# EAGLE design Power_Block (EAGLE 5.06)
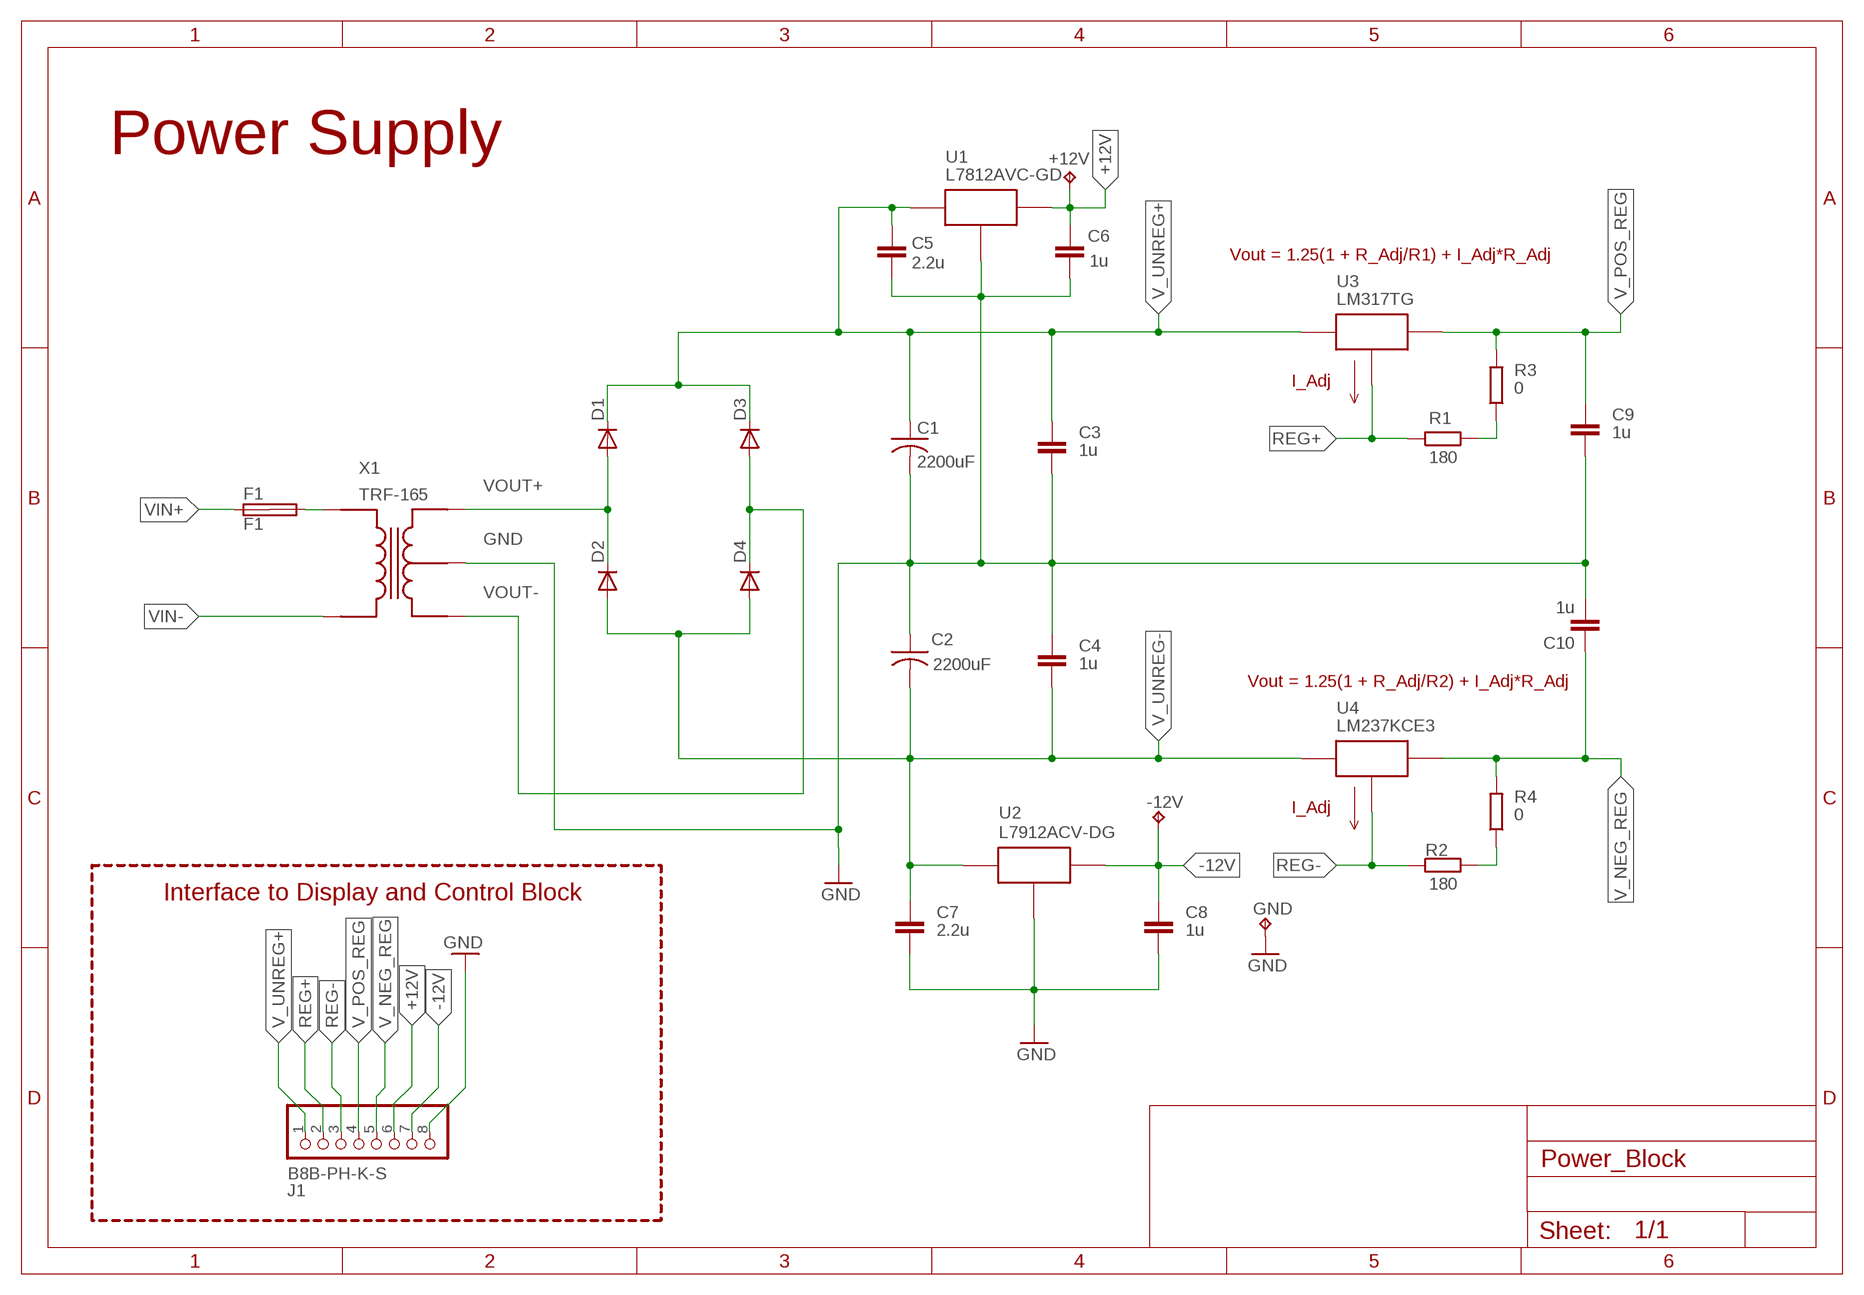
[diagram p0: schematic, sheet 1]

## Parts
+12V  TPTP20SQ  [TP20SQ]
-12V  TPTP20SQ  [TP20SQ]
C1  2200uF  ESK228M  [ESK228M]
C2  2200uF  ESK228M  [ESK228M]
C3  1u  C-EU025-024X044  [C025-024X044]
C4  1u  C-EU025-024X044  [C025-024X044]
C5  2.2u  C-EU025-024X044  [C025-024X044]
C6  1u  C-EU025-024X044  [C025-024X044]
C7  2.2u  C-EU025-024X044  [C025-024X044]
C8  1u  C-EU025-024X044  [C025-024X044]
C9  1u  C-EU025-024X044  [C025-024X044]
C10  1u  C-EU025-024X044  [C025-024X044]
D1  VS-2EFH02HM3/I  [DO-219AB]
D2  VS-2EFH02HM3/I  [DO-219AB]
D3  VS-2EFH02HM3/I  [DO-219AB]
D4  VS-2EFH02HM3/I  [DO-219AB]
F1  F1  SHK20L  [SHK20L]
GND  TPTP20SQ  [TP20SQ]
J1  B8B-PH-K-S  [B8B-PH-K-S]
R1  180  R-EU_R0603  [R0603]
R2  180  R-EU_R0603  [R0603]
R3  0  R-EU_R0603  [R0603]
R4  0  R-EU_R0603  [R0603]
U1  L7812AVC-GD  [T0-220]
U2  L7912ACV-DG  [T0-220]
U3  LM317TG  [T0-220]
U4  LM237KCE3  [T0-220]
X1  TRF-165  [TRF-165]

## Nets
+12V: +12V.TP C6.2 J1.6 U1.P3
-12V: -12V.TP C8.2 J1.7 U2.P3
GND: C1.LL- C2.LL+ C3.1 C4.2 C5.1 C6.1 C7.1 C8.1 C9.1 C10.2 GND.TP J1.8 U1.P2 U2.P1 X1.GND
N$15: R2.2 R4.1
N$17: R1.2 R3.1
N$20: F1.2A X1.VIN1
REG+: J1.2 R1.1 U3.P1
REG-: J1.3 R2.1 U4.P1
V_NEG_REG: C10.1 J1.5 R4.2 U4.P3
V_POS_REG: C9.2 J1.4 R3.2 U3.P2
V_UNREG+: C1.LL+ C3.2 C5.2 D1.C D3.C J1.1 U1.P1 U3.P3
V_UNREG-: C2.LL- C4.1 C7.2 D2.A D4.A U2.P2 U4.P2
VIN+: F1.1A
VIN-: X1.VIN2
VOUT+: D1.A D2.C X1.VOUT+
VOUT-: D3.A D4.C X1.VOUT-
Unconnected: F1.1B F1.2B

## Notes on the sheet
- Power Supply
- Vout = 1.25(1 + R_Adj/R1) + I_Adj*R_Adj
- I_Adj
- Vout = 1.25(1 + R_Adj/R2) + I_Adj*R_Adj
- I_Adj
- Interface to Display and Control Block

## Library data of the parts
+12V -12V GND = testpad:TP: Test pad
C1 C2 = VladimirG:ESK228M
C3-C10 = rcl:C-EU: CAPACITOR, European symbol
D1-D4 = VladimirG:VS-2EFH02HM3/I
F1 = fuse:SHK20L: FUSE HOLDER 5 x 20 mm, SH contact, SHH1 Schukat, E1073 Buerklin
J1 = VladimirG:B8B-PH-K-S: CONN HEADER VERT 8POS 2MM
R1-R4 = rcl:R-EU_: RESISTOR, European symbol
U1 = VladimirG:L7812AVC-GD: IC REG LINEAR 12V 1.5A TO220AB
U2 = VladimirG:L7912ACV-DG
U3 = VladimirG:LM317TG
U4 = VladimirG:LM237KCE3
X1 = VladimirG:TRF-165

## Board
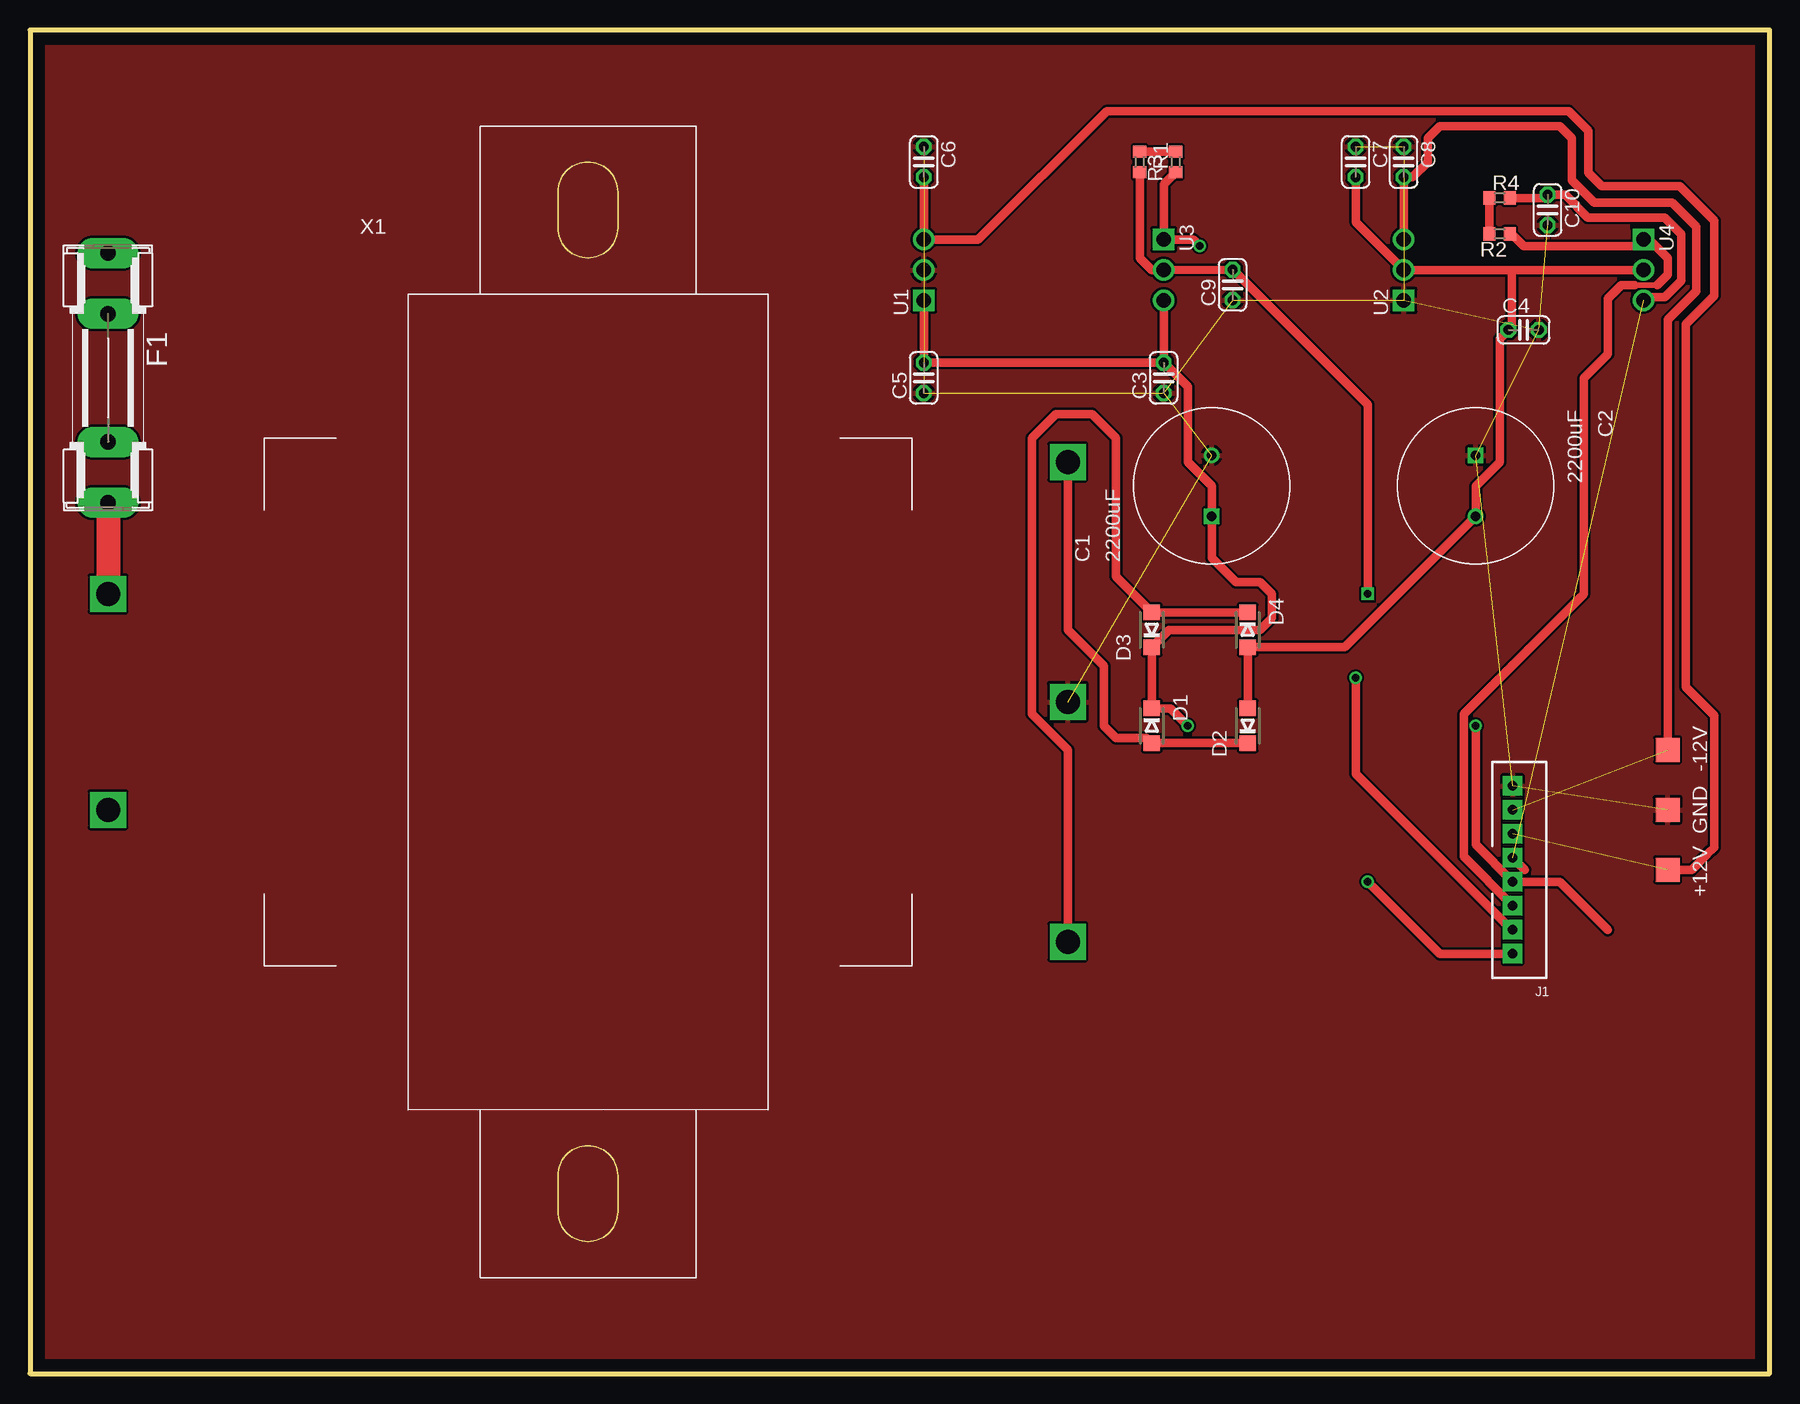
[diagram p1: board, top side]
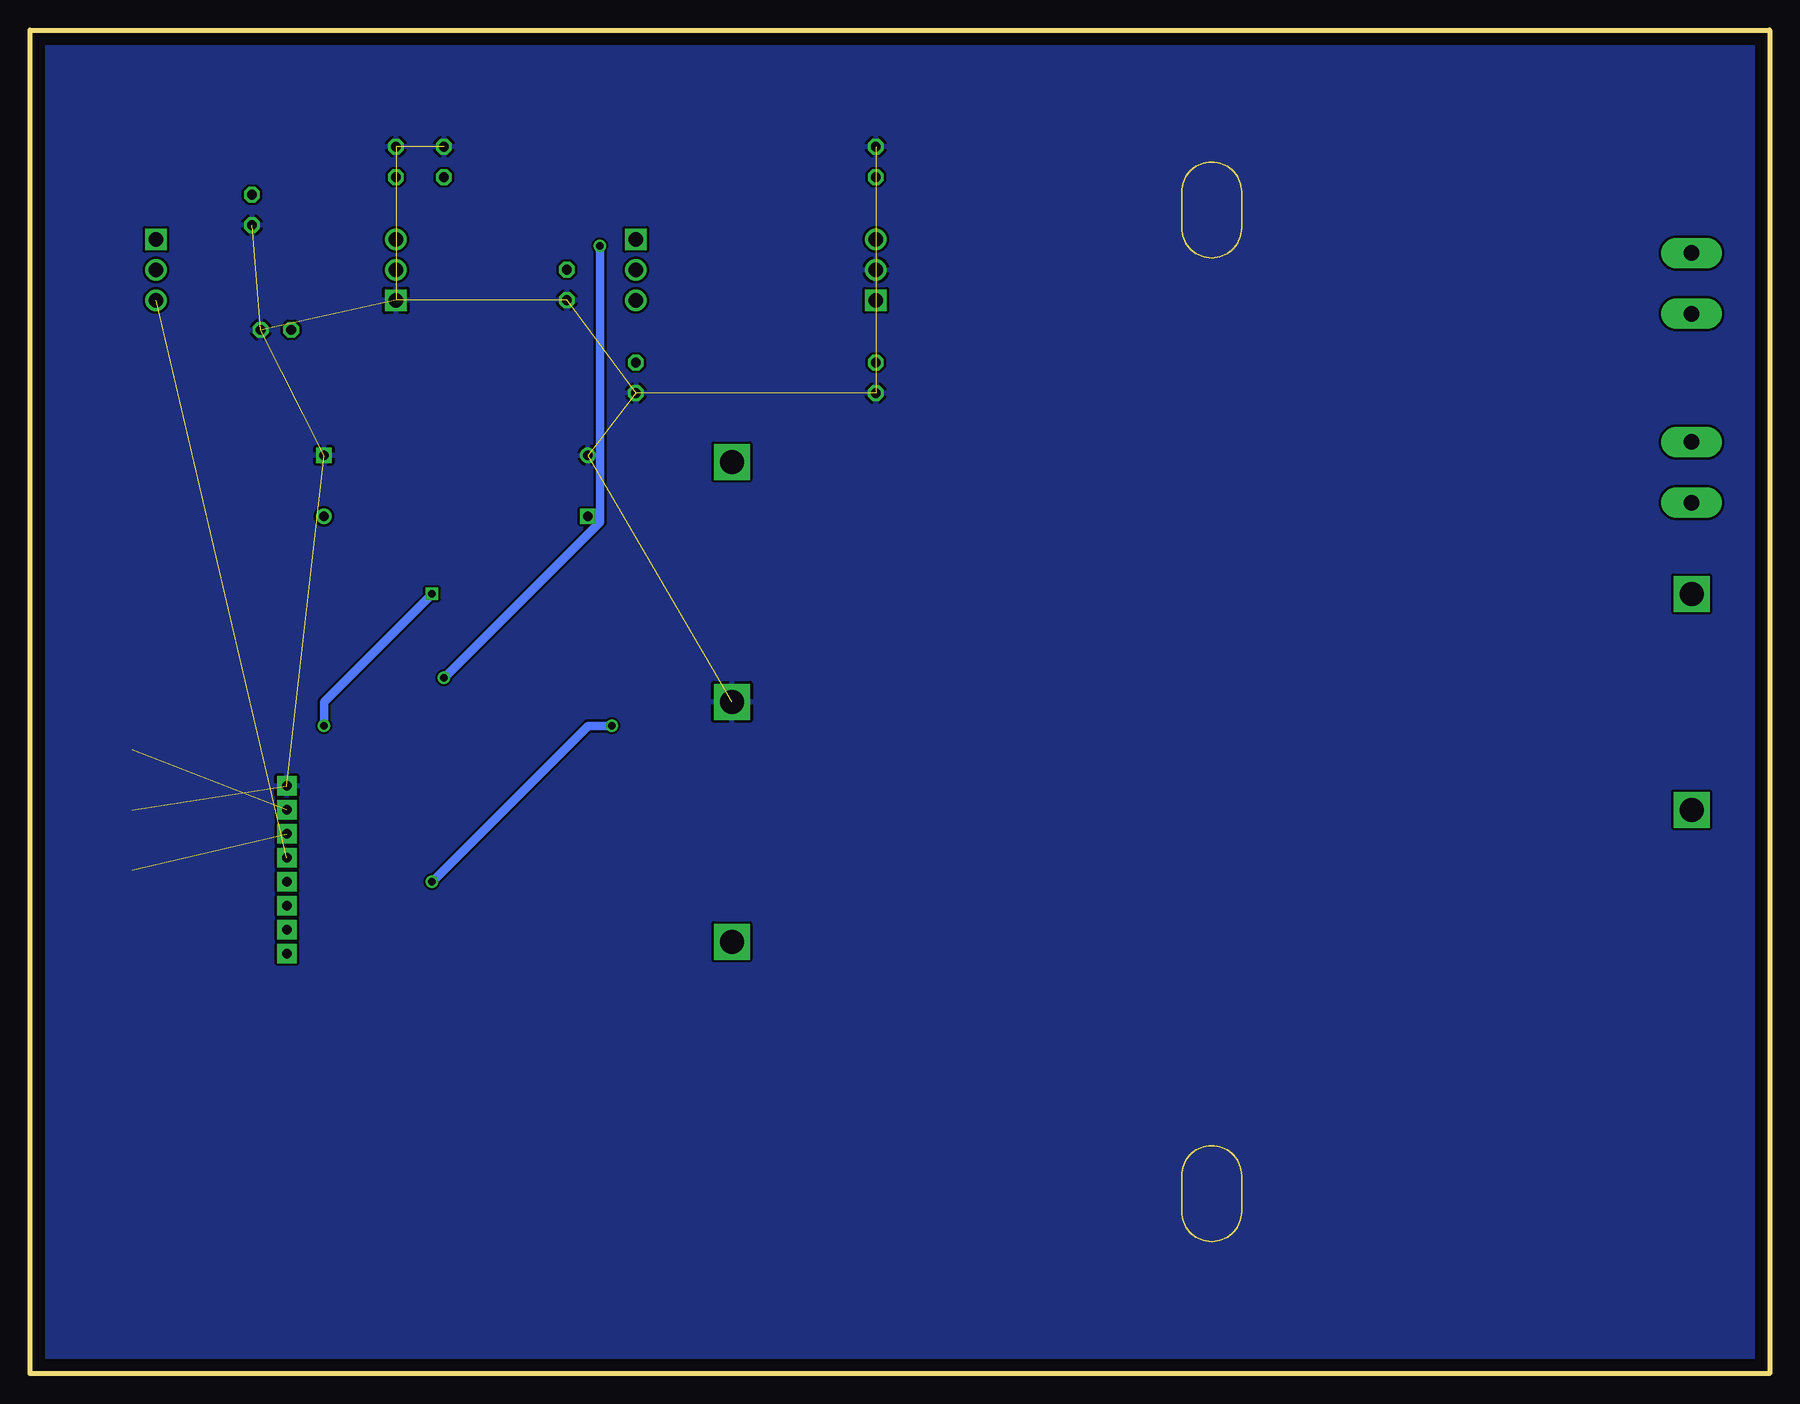
[diagram p2: board, bottom side, seen from below]

Size 145 x 112 mm. Coordinates in mm from the lower left corner, seen from the top.
Outline: 0,0 145,0 145,112 0,112 0,0
Copper layers (1*16): Top 0.035mm / dielectric 1.5mm / Bottom 0.035mm
Design rules "default": minimum track width 10mil, minimum drill 24mil, track to track 8mil, track to pad 8mil, pad to pad 8mil, via to via 8mil, smd to smd 8mil, copper to edge 40mil, drill to drill 8mil, minimum pad ring 10mil, minimum via ring 8mil, stop-mask expansion 4mil, vias tented up to drill 0mil, thermal gap 10mil

### Footprints (pad centres in the part's own frame; a part is rotated, then mirrored left to right if it is on the bottom)
TP20SQ = smd 2 x 2: TP 0,0
ESK228M = drill 0.762 square: LL+ -2.54,0 | drill 0.762 round: LL- 2.54,0
C025-024X044 = drill 0.813 octagon: 1 -1.27,0; 2 1.27,0
DO-219AB = smd 1.295 x 1.397: A -1.448,0; C 1.448,0
SHK20L = drill 1.321 pad 2.54 long: 1A -10.414,0; 1B -5.334,0; 2A 10.414,0; 2B 5.334,0
B8B-PH-K-S = drill 0.8 pad 1.6 square: 1 -0.085,7; 2 -0.085,5; 3 -0.085,3; 4 -0.085,1; 5 -0.085,-1; 6 -0.085,-3; 7 -0.085,-5; 8 -0.085,-7
R0603 = smd 1 x 1.1: 1 -0.85,0; 2 0.85,0
T0-220 = drill 1.2 pad 1.7 square: P1 -2.54,0 | drill 1.2 pad 1.7 round: P2 0,0; P3 2.54,0
TRF-165 = drill 2 square: GND 40,0; VIN1 -40,9; VIN2 -40,-9; VOUT+ 40,20; VOUT- 40,-20

### Placement (x,y rotation side)
+12V  136.5,42 270 top
-12V  136.5,52 270 top
C1  98.5,74 90 top
C2  120.5,74 270 top
C3  94.5,83 90 top
C4  124.5,87 0 top
C5  74.5,83 90 top
C6  74.5,101 270 top
C7  110.5,101 270 top
C8  114.5,101 270 top
C9  100.25,90.75 90 top
C10  126.5,97 270 top
D1  93.5,54 90 top
D2  101.5,54 270 top
D3  93.5,62 270 top
D4  101.5,62 90 top
F1  6.5,83 270 top
GND  136.5,47 270 top
J1  123.5,42 180 top
R1  95.5,101 90 top
R2  122.5,95 180 top
R3  92.5,101 270 top
R4  122.5,98 0 top
U1  74.5,92 90 top
U2  114.5,92 90 top
U3  94.5,92 270 top
U4  134.5,92 270 top
X1  46.5,56 0 top

### Tracks (layer width: path | path; a pad name or v marks a point on that pad's centre or on a via)
+12V  (1 unrouted)
  Top 0.7: C6.2 U1.P3 79.04,94.54 89.75,105.25 128.25,105.25 129.88,103.62 129.88,100.12 131,99 137.5,99 140.38,96.12 140.38,89.88 138,87.5 138,57.25 140.38,54.88 140.38,43.88 139.81,43.31 138.5,42 +12V.TP
-12V  (1 unrouted)
  Top 0.7: U2.P3 C8.2 115.23,99.73 116.5,101 116.5,103 117.5,104 127.5,104 128.5,103 128.5,99.5 130.38,97.62 136.88,97.62 138.88,95.62 138.88,90.25 136.5,87.88 136.5,73 -12V.TP
GND  (14 unrouted)
  pour Top: -1,-1 -1,113 146,113 146,-1
  pour Bottom: -2,-2 -2,114 147,114 147,-2
N$15
  Top 0.7: R2.2 R4.1
N$17
  Top 0.7: R3.1 R1.2
N$20
  Top 2: F1.2A X1.VIN1
REG+  (via drill 0.6)
  Top 0.7: R1.1 94.5,99.15 U3.P1 96.96,94.54 v97.5,94 | J1.2 123.5,37 110.5,50 v110.5,58
  Bottom 0.7: v110.5,58 97.5,71 v97.5,94
REG-
  Top 0.45: 133.75,90.75 135.62,90.75
  Top 0.7: J1.3 119.5,43.09 119.5,55 129.5,65 129.5,83 131.5,85 131.5,89.62 132.62,90.75 133.75,90.75 | 135.62,90.75 136.5,91.62 136.5,93 134.96,94.54 U4.P1 133.96,94 124.5,94 123.5,95 R2.1
V_NEG_REG  (1 unrouted)
  Top 0.7: U4.P3 134.79,89.75 136.25,89.75 137.62,91.12 137.62,95 136.25,96.38 129.85,96.38 127.96,98.27 C10.1 126.23,98 R4.2 | J1.5 124.59,42
V_POS_REG  (via drill 0.6)
  Top 0.7: R3.2 92.5,93 93.5,92 U3.P2 C9.2 111.5,80.77 v111.5,65 | 131.5,37 127.5,41 J1.4 120.5,44.09 v120.5,54
  Bottom 0.7: v120.5,54 120.5,56 v111.5,65
V_UNREG+  (via drill 0.6)
  Top 0.7: C3.2 U3.P3 | C3.2 C5.2 U1.P1 | J1.1 117.5,35 v111.5,41 | v96.5,54 95.05,55.45 D1.C D3.C 94.95,62 102.5,62 103.5,63 103.5,65 102.5,66 100.5,66 98.5,68 C1.LL+ 98.5,74 96.5,76 96.5,82.27 C3.2
  Bottom 0.7: v111.5,41 98.5,54 v96.5,54
V_UNREG-
  Top 0.7: 101.5,56 D2.A D4.A 109.59,60.55 C2.LL- 120.5,74 122.5,76 122.5,86.27 C4.1 123.5,87 123.5,92 | 123.5,92 U4.P2 | 123.5,92 U2.P2 110.5,96 C7.2
VOUT+
  Top 0.7: D2.C D1.A 93.05,53 90.5,53 89.5,54 89.5,59 86.5,62 X1.VOUT+
VOUT-
  Top 0.7: D4.C D3.A 90.5,66.45 90.5,78 88.5,80 85.5,80 83.5,78 83.5,55 86.5,52 X1.VOUT-